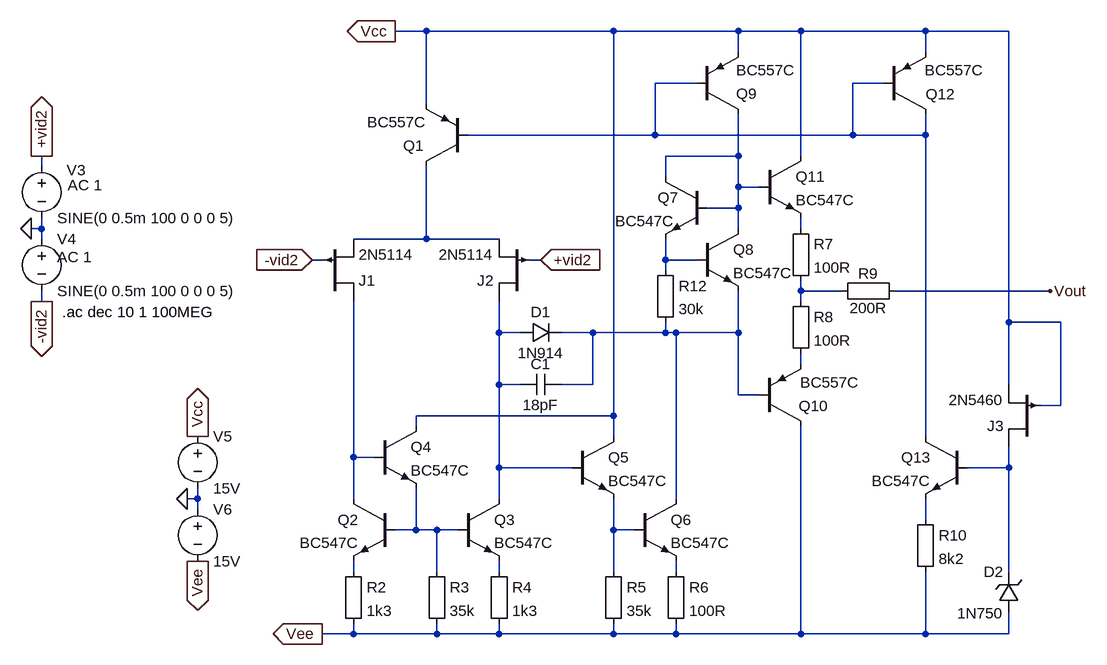
[diagram p0: schematic TL071_STM.asc]
TL071_STM.asc, the LTspice schematic file:
Version 4
SHEET 1 1360 756
WIRE -128 -272 -176 -272
WIRE 160 -272 -128 -272
WIRE 352 -272 160 -272
WIRE 448 -272 352 -272
WIRE 640 -272 448 -272
WIRE 768 -272 640 -272
WIRE 352 -240 352 -272
WIRE 640 -240 640 -272
WIRE 288 -192 224 -192
WIRE 576 -192 528 -192
WIRE -128 -160 -128 -272
WIRE 224 -112 224 -192
WIRE 224 -112 -64 -112
WIRE 528 -112 528 -192
WIRE 528 -112 224 -112
WIRE 640 -112 640 -144
WIRE 640 -112 528 -112
WIRE 352 -80 352 -144
WIRE 352 -80 240 -80
WIRE 448 -80 448 -272
WIRE -720 -64 -720 -80
WIRE 240 -48 240 -80
WIRE 352 -32 352 -80
WIRE 384 -32 352 -32
WIRE 352 0 352 -32
WIRE 352 0 304 0
WIRE -720 32 -720 16
WIRE -720 32 -736 32
WIRE 352 32 352 0
WIRE 448 32 448 16
WIRE -720 48 -720 32
WIRE -128 48 -128 -64
WIRE -128 48 -240 48
WIRE -16 48 -128 48
WIRE -288 80 -304 80
WIRE 48 80 32 80
WIRE 240 80 240 48
WIRE 288 80 240 80
WIRE 240 96 240 80
WIRE 448 128 448 112
WIRE 512 128 448 128
WIRE 832 128 592 128
WIRE -720 144 -720 128
WIRE 448 144 448 128
WIRE 768 176 768 -272
WIRE 848 176 768 176
WIRE -16 192 -16 144
WIRE 16 192 -16 192
WIRE 128 192 80 192
WIRE 240 192 240 176
WIRE 240 192 128 192
WIRE 256 192 240 192
WIRE 352 192 352 128
WIRE 352 192 256 192
WIRE 448 240 448 224
WIRE -16 272 -16 192
WIRE 16 272 -16 272
WIRE 128 272 128 192
WIRE 128 272 80 272
WIRE 768 272 768 176
WIRE 352 288 352 192
WIRE 384 288 352 288
WIRE 848 304 848 176
WIRE 848 304 816 304
WIRE 160 320 160 -272
WIRE 160 320 -144 320
WIRE -144 336 -144 320
WIRE 160 352 160 320
WIRE 640 352 640 -112
WIRE -240 384 -240 144
WIRE -208 384 -240 384
WIRE -16 400 -16 272
WIRE 96 400 -16 400
WIRE 768 400 768 368
WIRE 768 400 704 400
WIRE -480 448 -480 432
WIRE -480 448 -496 448
WIRE -240 448 -240 384
WIRE -16 448 -16 400
WIRE 256 448 256 192
WIRE -480 464 -480 448
WIRE 640 480 640 448
WIRE -144 496 -144 432
WIRE -144 496 -176 496
WIRE -112 496 -144 496
WIRE -80 496 -112 496
WIRE 160 496 160 448
WIRE 192 496 160 496
WIRE -240 560 -240 544
WIRE -112 560 -112 496
WIRE -16 560 -16 544
WIRE 160 560 160 496
WIRE 256 560 256 544
WIRE 768 560 768 400
WIRE -240 656 -240 640
WIRE -240 656 -288 656
WIRE -112 656 -112 640
WIRE -112 656 -240 656
WIRE -16 656 -16 640
WIRE -16 656 -112 656
WIRE 160 656 160 640
WIRE 160 656 -16 656
WIRE 256 656 256 640
WIRE 256 656 160 656
WIRE 448 656 448 336
WIRE 448 656 256 656
WIRE 640 656 640 560
WIRE 640 656 448 656
WIRE 768 656 768 624
WIRE 768 656 640 656
FLAG 832 128 Vout
FLAG -736 32 0
FLAG -720 144 -vid2
IOPIN -720 144 Out
FLAG -720 -80 +vid2
IOPIN -720 -80 Out
FLAG 48 80 +vid2
IOPIN 48 80 In
FLAG -304 80 -vid2
IOPIN -304 80 In
FLAG -480 352 Vcc
IOPIN -480 352 Out
FLAG -480 544 Vee
IOPIN -480 544 Out
FLAG -496 448 0
FLAG -176 -272 Vcc
IOPIN -176 -272 Out
FLAG -288 656 Vee
IOPIN -288 656 Out
SYMBOL pjf -288 144 M180
SYMATTR InstName J1
SYMATTR Value 2N5114
SYMBOL pjf 32 144 R180
SYMATTR InstName J2
SYMATTR Value 2N5114
SYMBOL pnp -64 -64 R180
WINDOW 0 67 32 Left 2
WINDOW 3 64 68 Left 2
SYMATTR InstName Q1
SYMATTR Value BC557C
SYMBOL npn -176 448 M0
SYMATTR InstName Q2
SYMATTR Value BC547C
SYMBOL npn -80 448 R0
SYMATTR InstName Q3
SYMATTR Value BC547C
SYMBOL npn -208 336 R0
SYMATTR InstName Q4
SYMATTR Value BC547C
SYMBOL npn 96 352 R0
SYMATTR InstName Q5
SYMATTR Value BC547C
SYMBOL npn 192 448 R0
SYMATTR InstName Q6
SYMATTR Value BC547C
SYMBOL diode 16 176 M90
WINDOW 0 0 32 VBottom 2
WINDOW 3 32 32 VTop 2
SYMATTR InstName D1
SYMATTR Value 1N914
SYMBOL cap 80 256 R90
WINDOW 0 0 32 VBottom 2
WINDOW 3 32 32 VTop 2
SYMATTR InstName C1
SYMATTR Value 18pF
SYMBOL npn 304 -48 M0
WINDOW 0 44 32 Left 2
WINDOW 3 51 68 Left 2
SYMATTR InstName Q7
SYMATTR Value BC547C
SYMBOL npn 288 32 R0
SYMATTR InstName Q8
SYMATTR Value BC547C
SYMBOL pnp 288 -144 M180
WINDOW 0 61 32 Left 2
WINDOW 3 61 68 Left 2
SYMATTR InstName Q9
SYMATTR Value BC557C
SYMBOL pnp 384 336 M180
WINDOW 0 61 31 Left 2
WINDOW 3 63 67 Left 2
SYMATTR InstName Q10
SYMATTR Value BC557C
SYMBOL npn 384 -80 R0
SYMATTR InstName Q11
SYMATTR Value BC547C
SYMBOL Misc\\EuropeanResistor -256 544 R0
SYMATTR InstName R2
SYMATTR Value 1k3
SYMBOL Misc\\EuropeanResistor -128 544 R0
SYMATTR InstName R3
SYMATTR Value 35k
SYMBOL Misc\\EuropeanResistor -32 544 R0
SYMATTR InstName R4
SYMATTR Value 1k3
SYMBOL Misc\\EuropeanResistor 144 544 R0
SYMATTR InstName R5
SYMATTR Value 35k
SYMBOL Misc\\EuropeanResistor 240 544 R0
SYMATTR InstName R6
SYMATTR Value 100R
SYMBOL Misc\\EuropeanResistor 432 16 R0
SYMATTR InstName R7
SYMATTR Value 100R
SYMBOL Misc\\EuropeanResistor 432 128 R0
SYMATTR InstName R8
SYMATTR Value 100R
SYMBOL Misc\\EuropeanResistor 608 112 R90
WINDOW 0 5 56 VBottom 2
WINDOW 3 27 56 VTop 2
SYMATTR InstName R9
SYMATTR Value 200R
SYMBOL pnp 576 -144 M180
WINDOW 0 64 31 Left 2
WINDOW 3 63 68 Left 2
SYMATTR InstName Q12
SYMATTR Value BC557C
SYMBOL npn 704 352 M0
SYMATTR InstName Q13
SYMATTR Value BC547C
SYMBOL Misc\\EuropeanResistor 624 464 R0
SYMATTR InstName R10
SYMATTR Value 8k2
SYMBOL pjf 816 368 R180
SYMATTR InstName J3
SYMATTR Value 2N5460
SYMBOL zener 784 624 R180
WINDOW 0 24 64 Left 2
WINDOW 3 24 0 Left 2
SYMATTR InstName D2
SYMATTR Value 1N750
SYMBOL Misc\\EuropeanResistor 224 80 R0
SYMATTR InstName R12
SYMATTR Value 30k
SYMBOL voltage -720 -80 R0
WINDOW 123 40 45 Left 2
WINDOW 39 0 0 Left 0
WINDOW 0 39 22 Left 2
SYMATTR Value2 AC 1
SYMATTR InstName V3
SYMATTR Value SINE(0 0.5m 100 0 0 0 5)
SYMBOL voltage -720 32 R0
WINDOW 123 24 44 Left 2
WINDOW 39 0 0 Left 0
SYMATTR Value2 AC 1
SYMATTR InstName V4
SYMATTR Value SINE(0 0.5m 100 0 0 0 5)
SYMBOL voltage -480 336 R0
WINDOW 123 0 0 Left 2
WINDOW 39 0 0 Left 2
SYMATTR InstName V5
SYMATTR Value 15V
SYMBOL voltage -480 448 R0
WINDOW 123 0 0 Left 2
WINDOW 39 0 0 Left 2
SYMATTR InstName V6
SYMATTR Value 15V
TEXT -688 160 Left 2 !.ac dec 10 1 100MEG

The netlist it stands for:
* TL071_STM.asc
J1 N010 -vid2 N004 2N5114
J2 N007 +vid2 N004 2N5114
Q1 N004 N001 Vcc 0 BC557C
Q2 N010 N013 N015 0 BC547C
Q3 N007 N013 N016 0 BC547C
Q4 Vcc N010 N013 0 BC547C
Q5 Vcc N007 N014 0 BC547C
Q6 N008 N014 N017 0 BC547C
D1 N007 N008 1N914
C1 N008 N007 18pF
Q7 N002 N002 N005 0 BC547C
Q8 N002 N005 N008 0 BC547C
Q9 N002 N001 Vcc 0 BC557C
Q10 Vee N008 N009 0 BC557C
Q11 Vcc N002 N003 0 BC547C
R2 N015 Vee 1k3
R3 N013 Vee 35k
R4 N016 Vee 1k3
R5 N014 Vee 35k
R6 N017 Vee 100R
R7 N003 N006 100R
R8 N006 N009 100R
R9 Vout N006 200R
Q12 N001 N001 Vcc 0 BC557C
Q13 N001 N011 N012 0 BC547C
R10 N012 Vee 8k2
J3 N011 Vcc Vcc 2N5460
D2 Vee N011 1N750
R12 N005 N008 30k
V3 +vid2 0 SINE(0 0.5m 100 0 0 0 5) AC 1
V4 0 -vid2 SINE(0 0.5m 100 0 0 0 5) AC 1
V5 Vcc 0 15V
V6 0 Vee 15V
.model D D
.lib standard.dio
.model NPN NPN
.model PNP PNP
.lib standard.bjt
.model NJF NJF
.model PJF PJF
.lib standard.jft
.ac dec 10 1 100MEG
.backanno
.end